# EAGLE schematic CSC (EAGLE 9.3.1)
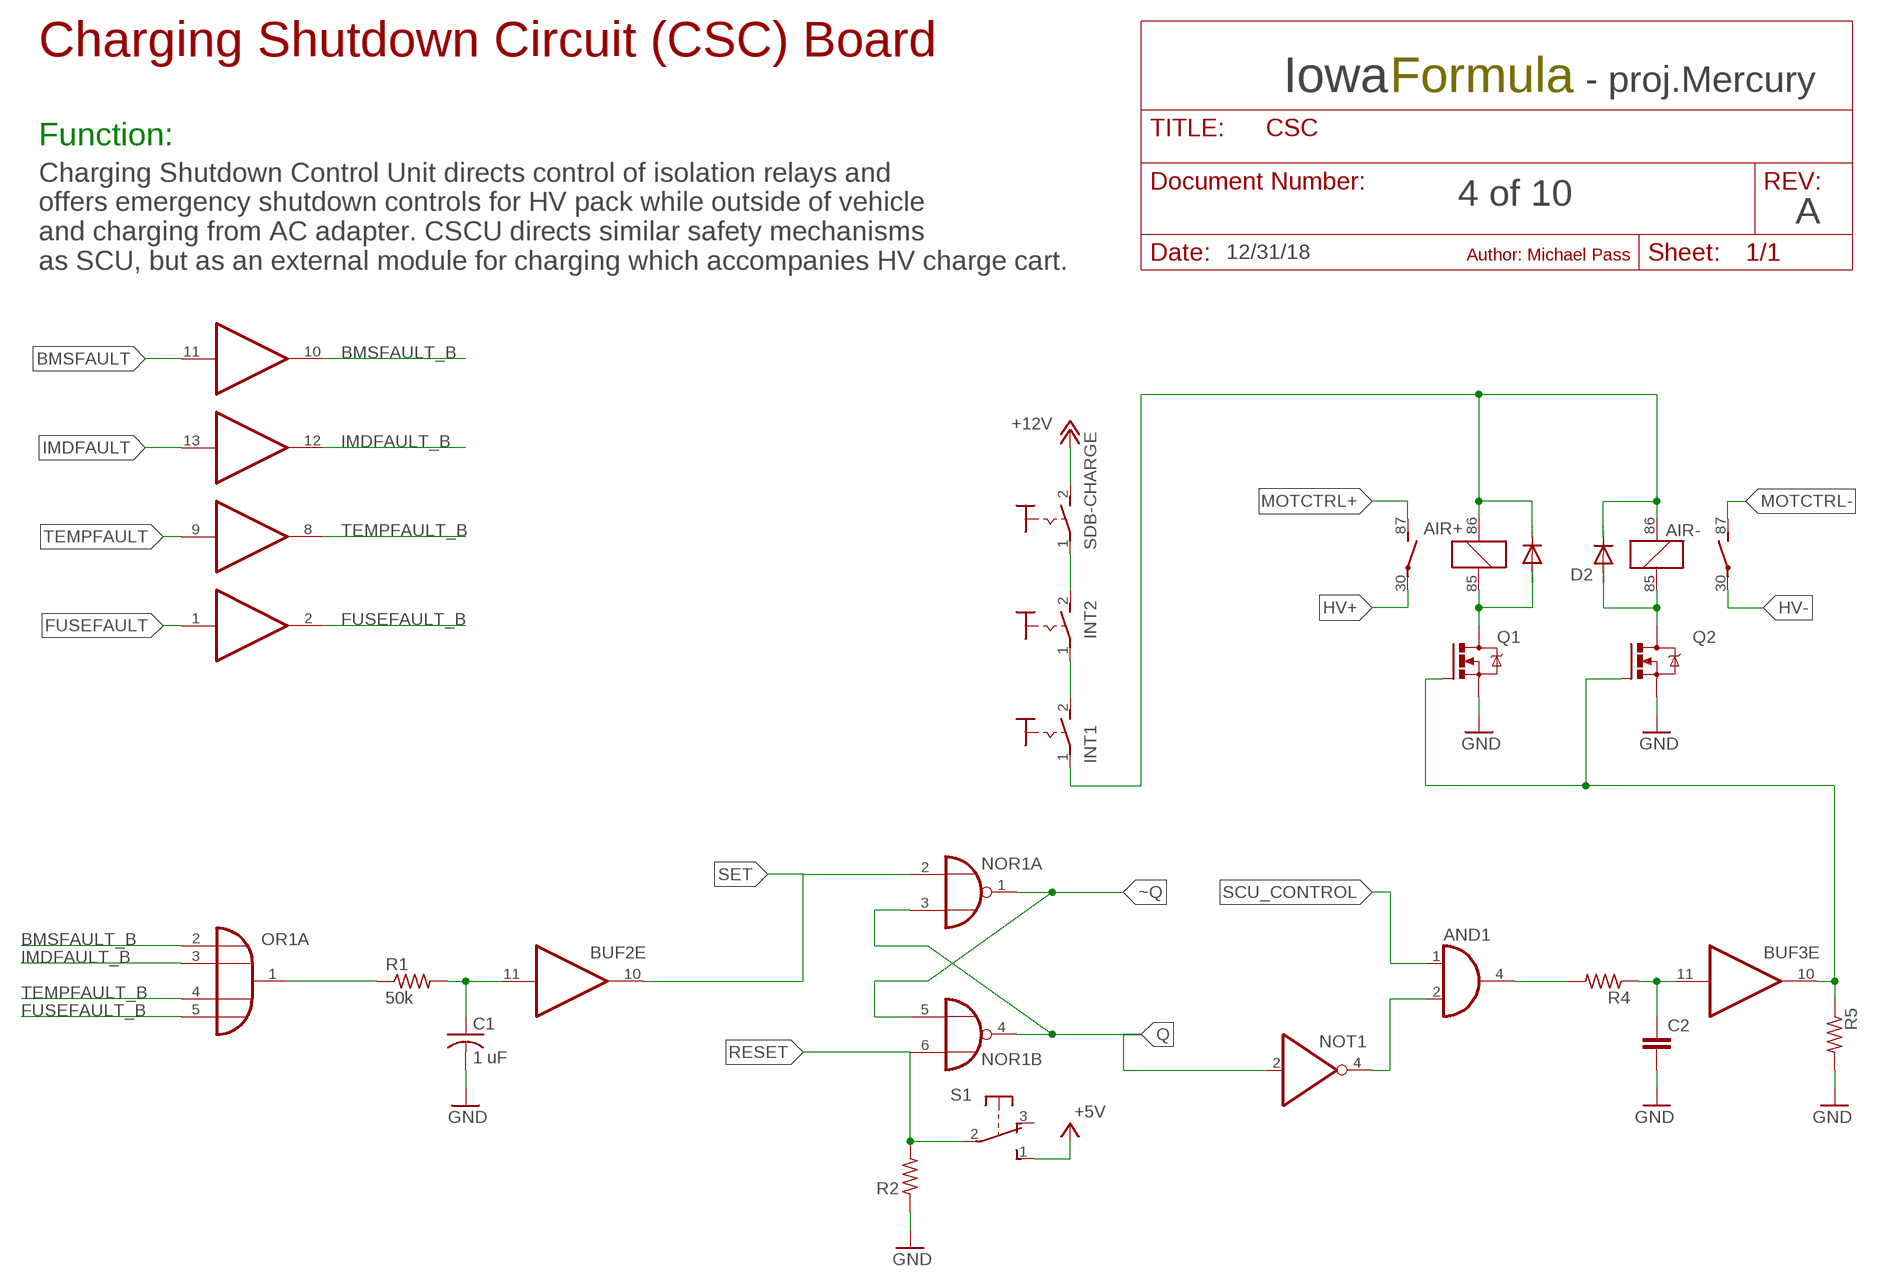
[diagram p0: schematic, sheet 1]

## Parts
AIR+  CB1A-P-12V  [CB1]
AIR-  CB1A-P-12V  [CB1]
AND1  74AHCT1G08DCK  [SC70-5]
BUF1  7407D  [SO14]
BUF2  7407D  [SO14]
BUF3  7407D  [SO14]
C1  1 uF  C-USC0805  [C0805]
C2  C-EUC0805  [C0805]
D1  1N4933  [DO41-10]
D2  1N4933  [DO41-10]
INT1  MS243  [MS243]
INT2  MS243  [MS243]
NOR1  74LS33D  [SO14]
NOT1  74LVC1G06DCK  [SC70-5]
OR1  4072D  [SO14]
Q1  IRLZ44Z  [TO220BH]
Q2  IRLZ44Z  [TO220BH]
R1  50k  R-US_R0805  [R0805]
R2  R-US_R0805  [R0805]
R4  R-US_R0805  [R0805]
R5  R-US_R0805  [R0805]
S1  9077-1  [9077-1]
SDB-CHARGE  MS243  [MS243]

## Nets
+5V: S1.1(S)
+12V: SDB-CHARGE.2(S)
AIR_CONTROL_SIGNAL: BUF3.10(E:O) Q1.G Q2.G R5.1
BMSFAULT: BUF1.11(E:I)
BMSFAULT_B: BUF1.10(E:O) OR1.2(A:I0)
FUSEFAULT: BUF2.1(A:I)
FUSEFAULT_B: BUF2.2(A:O) OR1.5(A:I3)
GND: C1.2 C2.2 Q1.S Q2.S R2.1 R5.2
HV+: AIR+.30(2:P)
HV-: AIR-.30(2:P)
IMDFAULT: BUF1.13(F:I)
IMDFAULT_B: BUF1.12(F:O) OR1.3(A:I1)
MOTCTRL+: AIR+.87(2:S)
MOTCTRL-: AIR-.87(2:S)
N$1: AND1.4(O) R4.2
N$4: AIR+.86 AIR-.86 D1.C D2.C INT1.1(P)
N$5: OR1.1(A:O) R1.1
N$6: BUF2.11(E:I) C1.1 R1.2
N$7: AIR-.85 D2.A Q2.D
N$8: AND1.2(I1) NOT1.4(O)
N$9: AIR+.85 D1.A Q1.D
N$10: INT2.2(S) SDB-CHARGE.1(P)
N$11: INT1.2(S) INT2.1(P)
N$20: BUF3.11(E:I) C2.1 R4.1
Q: NOR1.3(A:I1) NOR1.4(B:O) NOT1.2(I)
RESET: NOR1.6(B:I1) R2.2 S1.2(P)
SCU_CONTROL: AND1.1(I0)
SET: BUF2.10(E:O) NOR1.2(A:I0)
TEMPFAULT: BUF1.9(D:I)
TEMPFAULT_B: BUF1.8(D:O) OR1.4(A:I2)
~Q: NOR1.1(A:O) NOR1.5(B:I0)
Unconnected: BUF1.1(A:I) BUF1.2(A:O) BUF1.3(B:I) BUF1.4(B:O) BUF1.5(C:I) BUF1.6(C:O) BUF2.3(B:I) BUF2.4(B:O) BUF2.5(C:I) BUF2.6(C:O) BUF2.8(D:O) BUF2.9(D:I) BUF2.12(F:O) BUF2.13(F:I) BUF3.1(A:I) BUF3.2(A:O) BUF3.3(B:I) BUF3.4(B:O) BUF3.5(C:I) BUF3.6(C:O) BUF3.8(D:O) BUF3.9(D:I) BUF3.12(F:O) BUF3.13(F:I) NOR1.8(C:I0) NOR1.9(C:I1) NOR1.10(C:O) NOR1.11(D:I0) NOR1.12(D:I1) NOR1.13(D:O) OR1.9(B:I0) OR1.10(B:I1) OR1.11(B:I2) OR1.12(B:I3) OR1.13(B:O) S1.3(O)

## Notes on the sheet
- Charging Shutdown Circuit (CSC) Board
- Iowa | Formula | - proj.Mercury
- Function:
- 4 of 10
- A
- 12/31/18 | Author: Michael Pass
- Charging Shutdown Control Unit directs control of isolation relays and
  offers emergency shutdown controls for HV pack while outside of vehicle
  and charging from AC adapter. CSCU directs similar safety mechanisms
  as SCU, but as an external module for charging which accompanies HV charge cart.

## Power pins joined to a net without a drawn wire
GND: AND1.3(GND) BUF1.7(P:GND) BUF2.7(P:GND) BUF3.7(P:GND) NOR1.7(P:GND) NOT1.3(GND)
VCC: AND1.5(VCC) BUF1.14(P:VCC) BUF2.14(P:VCC) BUF3.14(P:VCC) NOR1.14(P:VCC) NOT1.5(VCC)
VDD: OR1.14(P:VDD)
VSS: OR1.7(P:VSS)

## Library data of the parts
AIR+ AIR- = relay:CB*: HIGH POWER AUTOMOTIVE RELAY Form A NAiS Source: http://www.mew-europe.com/.. en_ds_61202_0000.pdf; MF: AROMAT/ MATSUSHITA; MPN: CB1A-P-12V; OC_FARNELL: 1270582; OC_NEWARK: 50B849
AND1 = 74xx-little-de:74*1G08: 2-input AND gate
BUF1-BUF3 = 74xx-eu:74*07: Hex BUFFER, open collector high-voltage output
C1 = rcl:C-US: CAPACITOR, American symbol; SPICEPREFIX: C
C2 = rcl:C-EU: CAPACITOR, European symbol; SPICEPREFIX: C
D1 D2 = diode:1N4933: DIODE fast recovery rectifier, 1A
INT1 INT2 SDB-CHARGE = switch:MS243: TOGGLE SWITCH
NOR1 = 74xx-eu:74*33: Quad 2-input NOR buffer, open collector
NOT1 = 74xx-little-de:74*1G06: Single Inverter Buffer/Driver With Open-Drain Output
OR1 = 40xx:4072: Dual 4-input OR
Q1 Q2 = transistor-power:IRLZ44Z: N-Channel HEXFET® Power MOSFET Logic Level AUTOMOTIVE MOSFET Source: http://www.irf.com/product-info/datasheets/data/irlz44zpbf.pdf
R1 R2 R4 R5 = rcl:R-US_: RESISTOR, American symbol; SPICEPREFIX: R
S1 = switch-misc:9077-1: MARQUARDT SWITCH 9077.0100 Distributor: Buerklin <https://www.buerklin.com/default.asp?event=ShowArtikel%2812G2820%29&l=d&jump=ArtNr_12G2820>